# Altium project PIC-ENCODER.PrjPcb
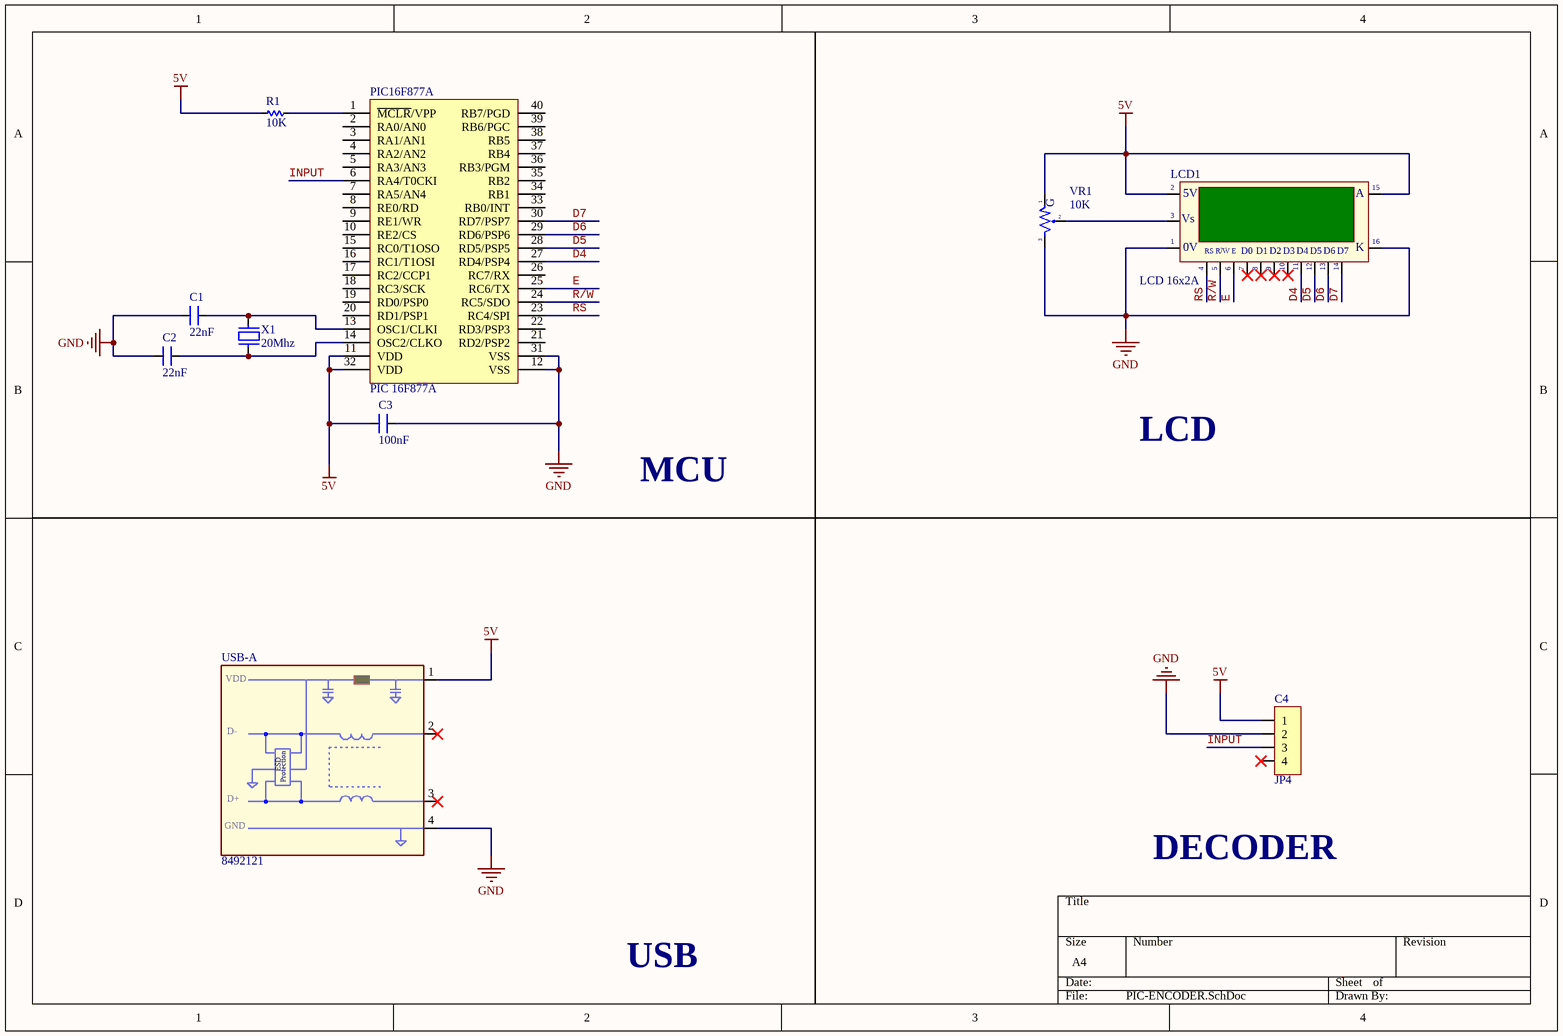
[diagram p0: PIC-ENCODER.SchDoc]
1 sheet, 10 parts. Net scope: global (net labels, ports and power ports of the same name join across sheets).
Board file: PIC-ENCODER.PcbDoc

## Sheet PIC-ENCODER.SchDoc
size A4

### Parts
C1  22nF  [CN1.5]
C2  22nF  [CN1.5]
C3  100nF  [CN1.5]
C4  JP4  [JP4-C1T]
LCD1  LCD 16x2A  [LCD16X2]
PIC16F877A  PIC 16F877A  [DIP40/W0.6]
R1  10K  [RES-1/4W]
USB-A  8492121  [USB-C1]
VR1  10K  [VR-S2]
X1  20Mhz  [XT2]

### Nets
5V: C3.1 C4.1 LCD1.2(VDD) LCD1.15(A) PIC16F877A.11(VDD) PIC16F877A.32(VDD) R1.2 USB-A.1(VBUS) VR1.1
GND: C1.1 C2.1 C3.2 C4.2 LCD1.1(GND) LCD1.16(K) PIC16F877A.12(VSS) PIC16F877A.31(VSS) USB-A.4(GND) VR1.3
D4: LCD1.11(D4) PIC16F877A.27(RD4/PSP4)
D5: LCD1.12(D5) PIC16F877A.28(RD5/PSP5)
D6: LCD1.13(D6) PIC16F877A.29(RD6/PSP6)
D7: LCD1.14(D7) PIC16F877A.30(RD7/PSP7)
E: LCD1.6(~{EN}) PIC16F877A.25(RC6/TX)
INPUT: C4.3 PIC16F877A.6(RA4/T0CKI)
R/W: LCD1.5(R/~{W}) PIC16F877A.24(RC5/SDO)
RS: LCD1.4(RS) PIC16F877A.23(RC4/SPI)
NetC1_2: C1.2 PIC16F877A.13(OSC1/CLKI) X1.2
NetC2_2: C2.2 PIC16F877A.14(OSC2/CLKO) X1.1
NetLCD1_3: LCD1.3(VEE) VR1.2
NetPIC16F877A_1: PIC16F877A.1(~{MCLR}/VPP) R1.1

Not connected (* = marked no-connect by the designer): C4 4*; LCD1 7(D0)* 8(D1)* 9(D2)* 10(D3)*; PIC16F877A 2(RA0/AN0) 3(RA1/AN1) 4(RA2/AN2) 5(RA3/AN3) 7(RA5/AN4) 8(RE0/RD) 9(RE1/WR) 10(RE2/CS) 15(RC0/T1OSO) 16(RC1/T1OSI) 17(RC2/CCP1) 18(RC3/SCK) 19(RD0/PSP0) 20(RD1/PSP1) 21(RD2/PSP2) 22(RD3/PSP3) 26(RC7/RX) 33(RB0/INT) 34(RB1) 35(RB2) 36(RB3/PGM) 37(RB4) 38(RB5) 39(RB6/PGC) 40(RB7/PGD); USB-A 2(D-)* 3(D+)*

### Notes on the sheet
- LCD
- MCU
- DECODER
- USB
- (in symbol LCD16x2A) 5V; Vs; |; 0V; R/W; E
- (in symbol USB-4) VDD; ESD; Protection
- (in symbol VR-S) G

### Library data of the parts
C1-C3 = CN: Value: 33pF
C4 = JP4: WR-PHD 2.54 mm Angled Socket Header; Manufacturer: W¨¹rth Elektronik eiSos GmbH; partNo: 613004143121; ComponentLink1 Description: Manufacturer; ComponentLink2 Description: Datasheet; NoPins: 04; Created Date: 29 March 2013; ComponentLink1URL: http://www.we-online.com; ComponentLink2URL: http://katalog.we-online.de/em/datasheet/6130xx143121.pdf; Created by: Karrer Zheng
LCD1 = LCD16x2A: LCD dipslay 16 char, 2 line; Value: LCD16x2A
PIC16F877A = PIC16F877-PU: 8K FLASH, 368B RAM, 256B EFROM; Value: DIP 40; Value: PIC16F877A; Copyright by: VanDungEvn
R1 = Res: Manufacturer: Generic Components; Class: Passive; SubClass: R; Published: 08/06/2000; Publisher: Altium Hobart Technology Centre
USB-A = USB-4: THT USB 2.0 A Connector WE-EPLE; Manufacturer: Würth Elektronik eiSos GmbH; PartNo: 8492121; ComponentLink1Description: Manufacturer; ComponentLink1URL: http://www.we-online.de; Created by: Christin Otto; Created Date: OCT-2014; ComponentLink2Description: Datasheet; ComponentLink2URL: http://www.we-online.de/katalog/media/pdf/8492121.pdf
VR1 = VR-S: Var Resistor; Value: Volume 50k
X1 = XT2: Crystal, 32.768 KHz, -40 to 85 degC, 3.2 x 1.5 x 0.9 mm SMD; Value: 4Mhz